# Altium schematic sheet Magnetometer_Filter.SchDoc: Hrafn
size Tabloid; DrawnBy: Nicholas Belsten; Organization: MIT; Address1: Route 40; Address2: Westford MA 01886; Address3: USA; DocumentNumber: 4; SheetNumber: 5; SheetTotal: 10; DCN: Aika; ProgramName: AERO-VISTA; Section: Magnetometer Filter
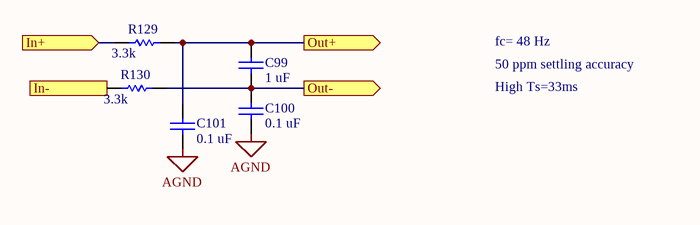
[diagram p0: Magnetometer_Filter.SchDoc]

## Parts
C99  1 uF  [CAPC1005X60X30NL05T10]
C100  0.1 uF  [CAPC0402(1005)60_L]
C101  0.1 uF  [CAPC0402(1005)60_L]
R129  Resistance: 3.3k  [RESC1005X40X25LL05T05]  (hidden comment: CRCW04023K30JNED)
R130  Resistance: 3.3k  [RESC1005X40X25LL05T05]  (hidden comment: CRCW04023K30JNED)

## Ports
In+ (in), In- (in), Out+ (out), Out- (out)

## Nets
AGND: C100.1 C101.1
In+: R129.1 ; port In+
In-: R130.1 ; port In-
Out+: C99.2 C101.2 R129.2 ; port Out+
Out-: C99.1 C100.2 R130.2 ; port Out-

## Notes on the sheet
- fc= 48 Hz
- 50 ppm settling accuracy
- High Ts=33ms
- Title
- Size
- Date
- Tabloid
- Section
- Time
- Sheet
- of
- Revision
- Drawn
- 33-207 / 77 Mass. Ave.
- Cambridge, MA 02139
- File

## Library data of the parts
C99 = CMP-2008-02056-1: Part Number: C0402C105M8PACTU; Manufacturer: Kemet; Capacitance: 1 uF
C100 C101 = CMP-1034-02068-1: CAP 100nF 16V ±5% 0402 (1005 Metric) Thickness 0.6mm SMD; Tolerance: Â±5%; Case-EIA: 0402; Case-Metric: 1005; Technology: SMT; Value: 100nF; Max Thickness: 0.6 mm; Rated Voltage: 16 V
R129 R130 = CMP-2002-08581-1: Manufacturer: Vishay Dale; Part Number: CRCW04023K30JNED